# Altium schematic sheet USB-RS485_A2.SchDoc: Приставка
size 594 x 420 mm; ApprovedBy: Рогов; CheckedBy: Капустин Д.А.; DrawnBy: Нечаева А.Н.; DocumentNumber: СПбПУ 28.12.2018 ЭЗ; SheetTotal: 1; Format: A2; DocumentType: Схема электрическая принципиальная; Title1str: Преобразователя напряжения
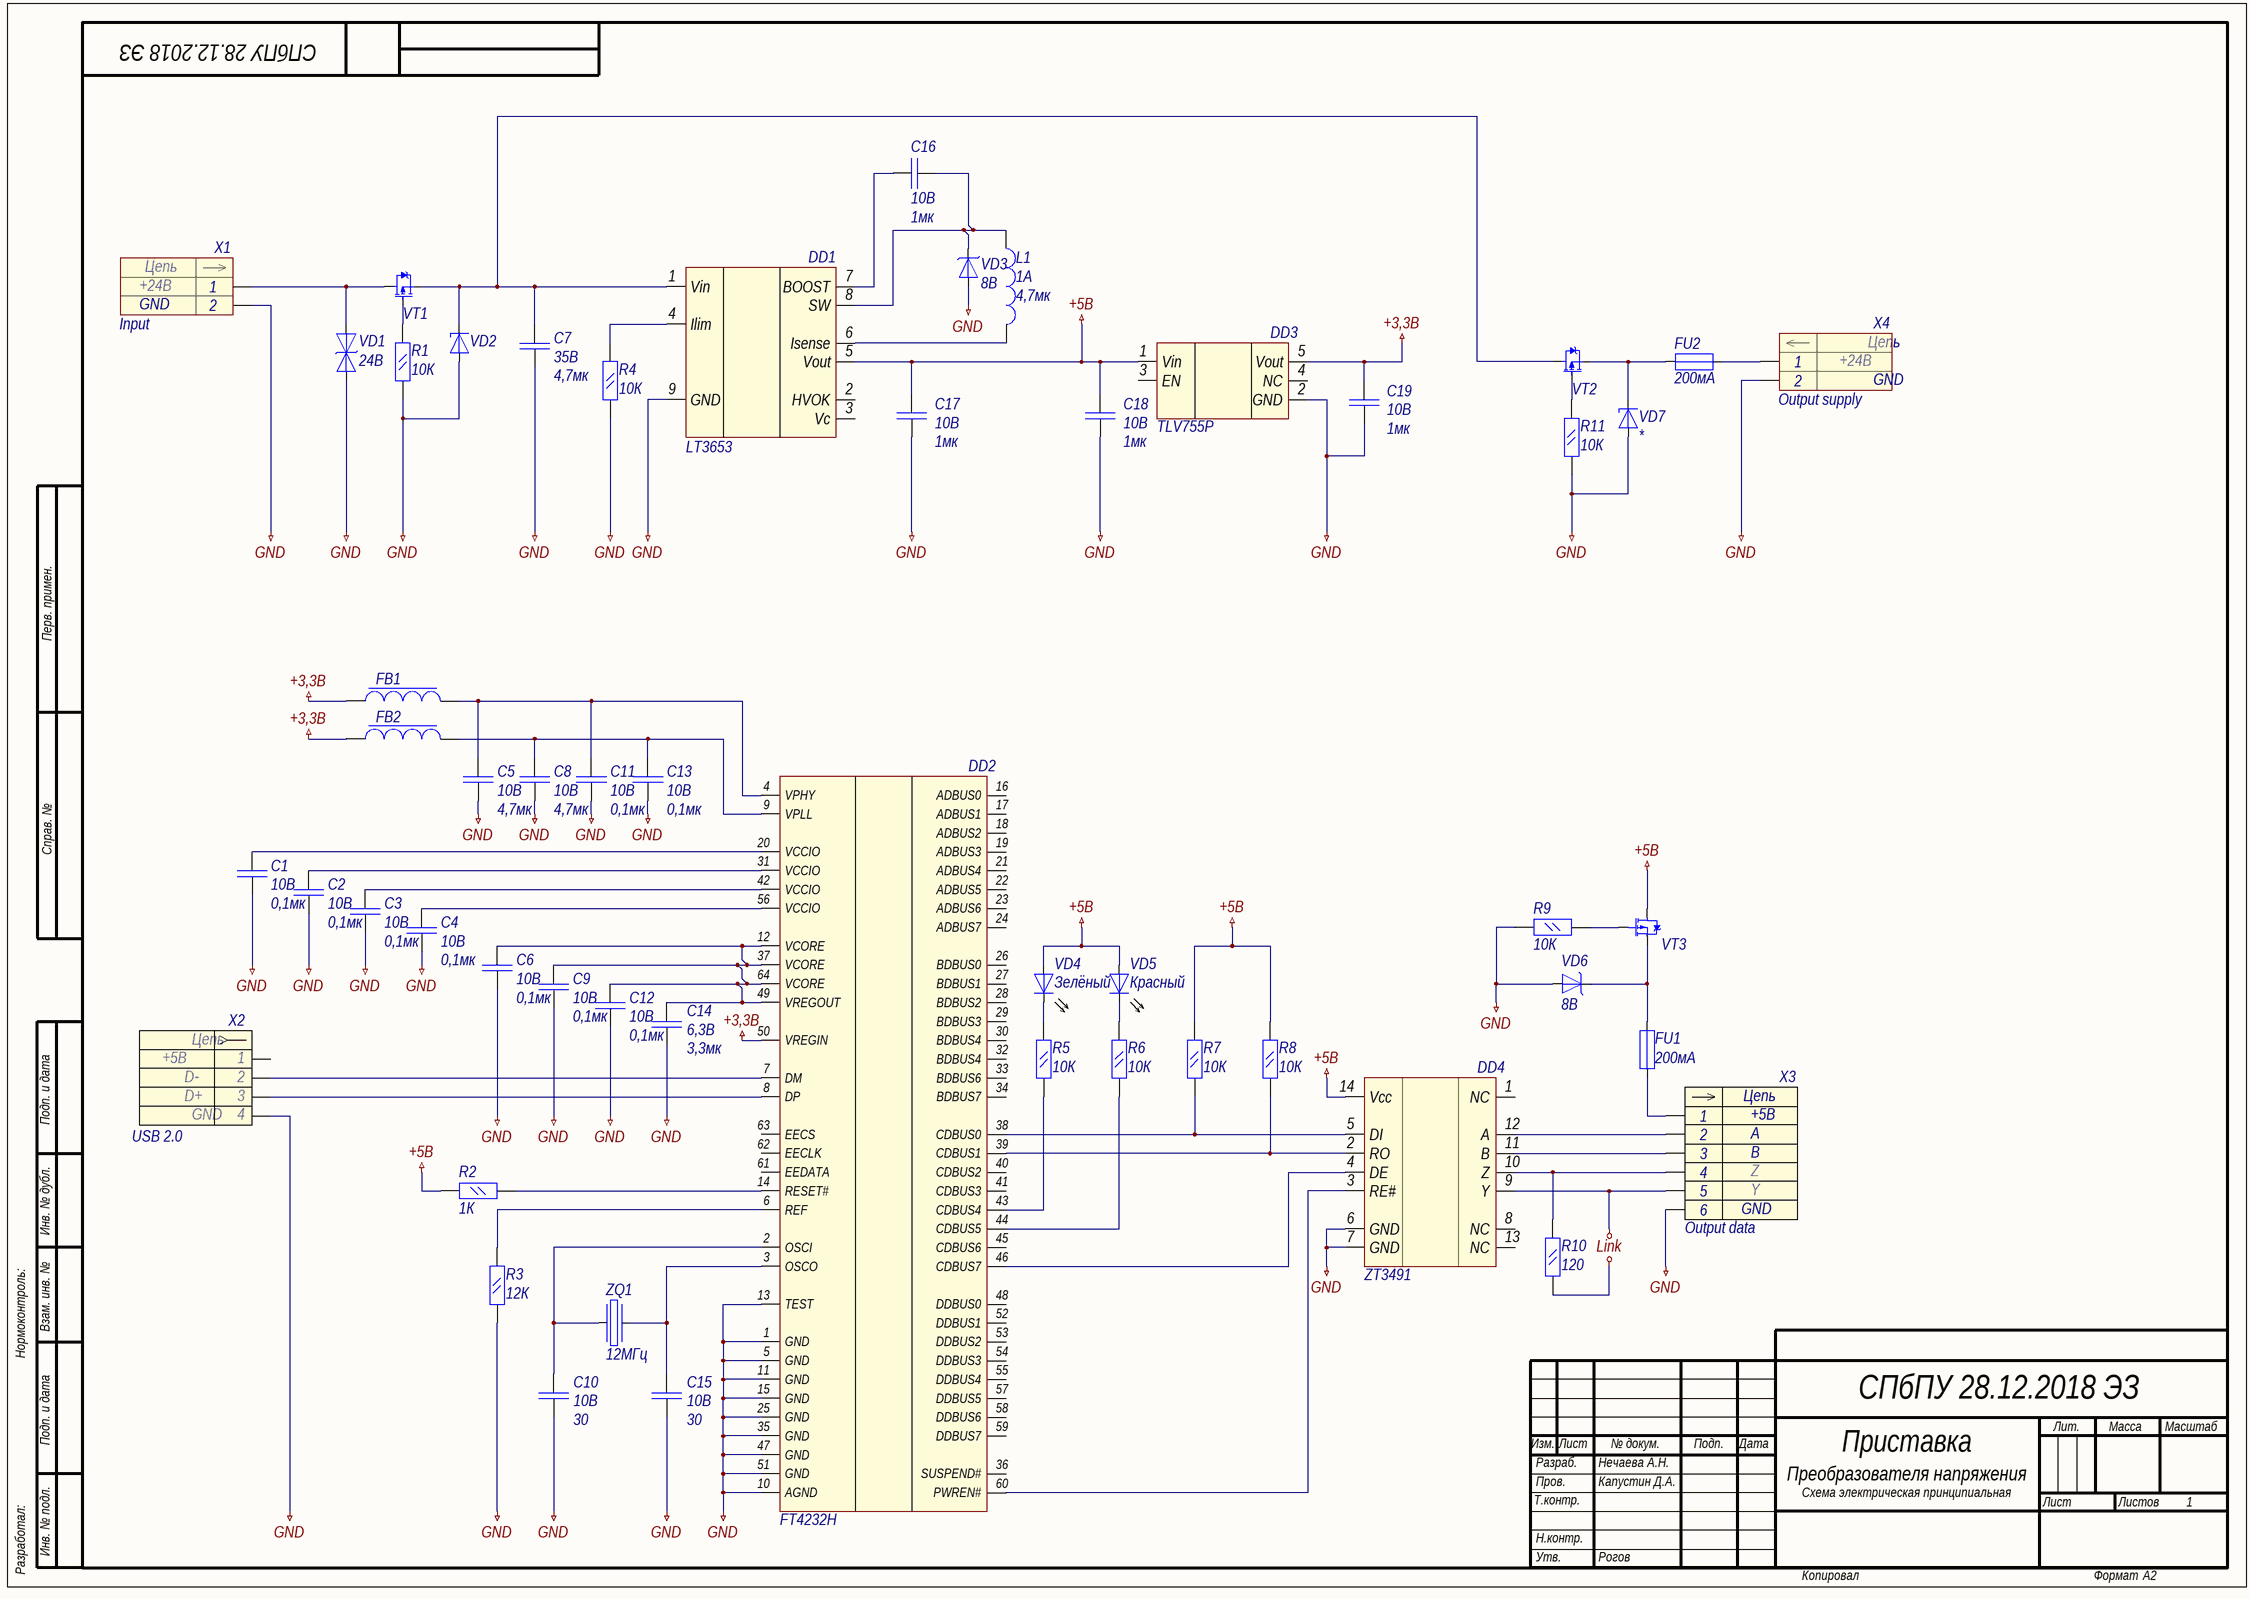
[diagram p0: USB-RS485_A2.SchDoc]

## Parts
C1  Voltage: 10В  Capacitance: 0,1мк  [CH0402C]  (hidden comment: Capacitor)
C2  Voltage: 10В  Capacitance: 0,1мк  [CH0402C]  (hidden comment: Capacitor)
C3  Voltage: 10В  Capacitance: 0,1мк  [CH0402C]  (hidden comment: Capacitor)
C4  Voltage: 10В  Capacitance: 0,1мк  [CH0402C]  (hidden comment: Capacitor)
C5  Voltage: 10В  Capacitance: 4,7мк  [CH0402C]  (hidden comment: Capacitor)
C6  Voltage: 10В  Capacitance: 0,1мк  [CH0402C]  (hidden comment: Capacitor)
C7  Voltage: 35В  Capacitance: 4,7мк  [CH0603C]  (hidden comment: Capacitor)
C8  Voltage: 10В  Capacitance: 4,7мк  [CH0402C]  (hidden comment: Capacitor)
C9  Voltage: 10В  Capacitance: 0,1мк  [CH0402C]  (hidden comment: Capacitor)
C10  Voltage: 10В  Capacitance: 30  [CH0201C]  (hidden comment: Capacitor)
C11  Voltage: 10В  Capacitance: 0,1мк  [CH0402C]  (hidden comment: Capacitor)
C12  Voltage: 10В  Capacitance: 0,1мк  [CH0402C]  (hidden comment: Capacitor)
C13  Voltage: 10В  Capacitance: 0,1мк  [CH0402C]  (hidden comment: Capacitor)
C14  Voltage: 6,3В  Capacitance: 3,3мк  [CH0402C]  (hidden comment: Capacitor)
C15  Voltage: 10В  Capacitance: 30  [CH0201C]  (hidden comment: Capacitor)
C16  Voltage: 10В  Capacitance: 1мк  [CH0201C]  (hidden comment: Capacitor)
C17  Voltage: 10В  Capacitance: 1мк  [CH0201C]  (hidden comment: Capacitor)
C18  Voltage: 10В  Capacitance: 1мк  [CH0201C]  (hidden comment: Capacitor)
C19  Voltage: 10В  Capacitance: 1мк  [CH0201C]  (hidden comment: Capacitor)
DD1  LT3653  [LT3653]
DD2  FT4232H  [FT4232]
DD3  TLV755P  [SOT23-5]
DD4  ZT3491  [ZT3485E]
FB1  Ferrite bead  [CH0805F]  (value not drawn)
FB2  Ferrite bead  [CH0805F]  (value not drawn)
FU1  value 200мА  [CH0402R]  (hidden comment: Fuse)
FU2  value 200мА  [CH0402R]  (hidden comment: Fuse)
L1  Max current: 1А  Inductance: 4,7мк  [CH0805L]  (hidden comment: Inductor)
R1  Impedance: 10К  [CH0402R]  (hidden comment: Res_0.125)
R2  Impedance: 1К  [CH0402R]  (hidden comment: Res_0.125)
R3  Impedance: 12К  [CH0805R]  (hidden comment: Res_0.125)
R4  Impedance: 10К  [CH0402R]  (hidden comment: Res_0.125)
R5  Impedance: 10К  [CH0402R]  (hidden comment: Res_0.125)
R6  Impedance: 10К  [CH0402R]  (hidden comment: Res_0.125)
R7  Impedance: 10К  [CH0402R]  (hidden comment: Res_0.125)
R8  Impedance: 10К  [CH0402R]  (hidden comment: Res_0.125)
R9  Impedance: 10К  [CH0402R]  (hidden comment: Res_0.125)
R10  Impedance: 120  [CH0402R]  (hidden comment: Res_0.125)
R11  Impedance: 10К  [CH0402R]  (hidden comment: Res_0.125)
VD1  Thresh_Voltage: 24В  [SOD323]  (hidden comment: TVS-diod_simmetrical)
VD2  Diod Zener  [SOD123]  (value not drawn)
VD3  Clamping_Voltage: 8В  [SOD123W]  (hidden comment: TVS-diod_directed)
VD4  Color: Зелёный  [CH0201L]  (hidden comment: Light_diod)
VD5  Color: Красный  [CH0201L]  (hidden comment: Light_diod)
VD6  Clamping_Voltage: 8В  [SOD123W]  (hidden comment: TVS-diod_directed)
VD7  Diod Zener  [SOD123]  (value not drawn)
VT1  P-Channel  [SOT23_132]  (value not drawn)
VT2  P-Channel  [SOT23_132]  (value not drawn)
VT3  *  [SOT23_132]  (value not drawn)
X1  Input  Vcc: +24В  [CON: 163-179PH-EX]
X2  USB 2.0  Vcc: +5В  [USB]
X3  Output data  Vcc: +5В  [CON: PBS-6]
X4  Output supply  Vcc: +24В  [CON: PBS-2]
ZQ1  value 12МГц  [OSC: 5032]  (hidden comment: Oscillator)

## Nets
+3,3В: C19.1(C1+) DD2.50(VREGIN) DD3.5(Vout) FB1.1(C1-) FB2.1(C1-)
+5В: C17.1(C1+) C18.1(C1+) DD1.5(Vout) DD3.1(Vin) DD4.14(Vcc) R2.2 R7.2 R8.2 VD4.1 VD5.1 VT3.2(D)
GND: C1.2(C1-) C2.2(C1-) C3.2(C1-) C4.2(C1-) C5.2(C1-) C6.2(C1-) C7.2(C1-) C8.2(C1-) C9.2(C1-) C10.2(C1-) C11.2(C1-) C12.2(C1-) C13.2(C1-) C14.2(C1-) C15.2(C1-) C17.2(C1-) C18.2(C1-) C19.2(C1-) DD1.9(GND) DD2.1(GND) DD2.5(GND) DD2.10(AGND) DD2.11(GND) DD2.13(TEST) DD2.15(GND) DD2.25(GND) DD2.35(GND) DD2.47(GND) DD2.51(GND) DD3.2(GND) DD4.6(GND) DD4.7(GND) R1.1 R3.1 R4.1 R9.2 R11.1 VD1.1(A) VD2.1(A) VD3.1(A) VD6.1(A) VD7.1(A) X1.2 X2.4 X3.6 X4.2
Link: DD4.9(Y) R10.1 X3.5
NetC1_1: C1.1(C1+) DD2.20(VCCIO)
NetC2_1: C2.1(C1+) DD2.31(VCCIO)
NetC3_1: C3.1(C1+) DD2.42(VCCIO)
NetC4_1: C4.1(C1+) DD2.56(VCCIO)
NetC5_1: C5.1(C1+) C11.1(C1+) DD2.4(VPHY) FB1.2
NetC6_1: C6.1(C1+) C9.1(C1+) C12.1(C1+) C14.1(C1+) DD2.12(VCORE) DD2.37(VCORE) DD2.49(VREGOUT) DD2.64(VCORE)
NetC7_1: C7.1(C1+) DD1.1(Vin) VD2.2(C) VT1.3(S) VT2.2(D)
NetC8_1: C8.1(C1+) C13.1(C1+) DD2.9(VPLL) FB2.2
NetC10_1: C10.1(C1+) DD2.2(OSCI) ZQ1.1
NetC15_1: C15.1(C1+) DD2.3(OSCO) ZQ1.3
NetC16_1: C16.1(C1+) DD1.7(BOOST)
NetC16_2: C16.2(C1-) DD1.8(SW) L1.1 VD3.2(C)
NetDD1_4: DD1.4(Ilim) R4.2
NetDD1_6: DD1.6(Isense) L1.2
NetDD2_6: DD2.6(REF) R3.2
NetDD2_7: DD2.7(DM) X2.2
NetDD2_8: DD2.8(DP) X2.3
NetDD2_14: DD2.14(RESET#) R2.1
NetDD2_38: DD2.38(CDBUS0) DD4.5(DI) R7.1
NetDD2_39: DD2.39(CDBUS1) DD4.2(RO) R8.1
NetDD2_43: DD2.43(CDBUS4) R5.1
NetDD2_44: DD2.44(CDBUS5) R6.1
NetDD2_46: DD2.46(CDBUS7) DD4.4(DE)
NetDD2_60: DD2.60(PWREN#) DD4.3(RE#)
NetDD4_10: DD4.10(Z) R10.2 X3.4
NetDD4_11: DD4.11(B) X3.3
NetDD4_12: DD4.12(A) X3.2
NetFU1_1: FU1.1 X3.1
NetFU1_2: FU1.2 VD6.2(C) VT3.3(S)
NetFU2_1: FU2.1 VD7.2(C) VT2.3(S)
NetFU2_2: FU2.2 X4.1
NetR1_2: R1.2 VT1.1(G)
NetR5_2: R5.2 VD4.2
NetR6_2: R6.2 VD5.2
NetR9_1: R9.1 VT3.1(G)
NetR11_2: R11.2 VT2.1(G)
NetVD1_2: VD1.2(C) VT1.2(D) X1.1

Not connected (* = marked no-connect by the designer): DD1 2(HVOK) 3(Vc); DD2 16(ADBUS0) 17(ADBUS1) 18(ADBUS2) 19(ADBUS3) 21(ADBUS4) 22(ADBUS5) 23(ADBUS6) 24(ADBUS7) 26(BDBUS0) 27(BDBUS1) 28(BDBUS2) 29(BDBUS3) 30(BDBUS4) 32(BDBUS4) 33(BDBUS6) 34(BDBUS7) 36(SUSPEND#) 40(CDBUS2) 41(CDBUS3) 45(CDBUS6) 48(DDBUS0) 52(DDBUS1) 53(DDBUS2) 54(DDBUS3) 55(DDBUS4) 57(DDBUS5) 58(DDBUS6) 59(DDBUS7) 61(EEDATA) 62(EECLK) 63(EECS); DD3 3(EN) 4(NC); DD4 1(NC) 8(NC) 13(NC); X2 1

## Notes on the sheet
- Перв. примен.
- Справ. №
- Подп. и дата
- Инв. № дубл.
- Нормоконтроль:
- Взам. инв. №
- Изм.
- Лист
- № докум.
- Подп.
- Дата
- Лит.
- Масса
- Масштаб
- Т.контр.
- Пров.
- Разраб.
- Листов
- Разработал:
- Инв. № подл.
- Н.контр.
- Утв.
- Копировал
- Формат
- (in symbol 2_pins) Цепь; GND
- (in symbol Full_Duplex_RS485) Цепь; GND
- (in symbol USB-A) Цепь; D-; D+; GND

## Library data of the parts
C1-C4 C6 C9 C11-C13 = Capacitor: Manufacture: AVX; Model: 0402ZD103KAT2A; Case: 0402; HelpURL: https://ru.mouser.com/ProductDetail/AVX/0402ZD103KAT2A?qs=sGAEpiMZZMs0AnBnWHyRQKdiqyDPVQdAu74W%2fwwRq8A%3d
C5 C8 = Capacitor: Manufacture: Murata Electronics; Model: ZRB15XR61A475KE01D; Case: 0402; HelpURL: https://ru.mouser.com/ProductDetail/Murata-Electronics/ZRB15XR61A475KE01D?qs=sGAEpiMZZMs0AnBnWHyRQO9VYadaKTO%252beZnE9zFUsbv4FmCibz4ZfQ%3d%3d
C7 = Capacitor: Manufacture: TDK; Model: C1608JB1V475M080AC; Case: 0603; HelpURL: https://ru.mouser.com/ProductDetail/TDK/C1608JB1V475M080AC?qs=sGAEpiMZZMs0AnBnWHyRQFv7x1xn%252bYFd6VAPnwlpyGEmZrVGUJGxTQ%3d%3d
C10 C15 = Capacitor: Manufacture: KEMET; Model: CBR02C308B8GAC; Case: 0201; HelpURL: https://ru.mouser.com/ProductDetail/KEMET/CBR02C308B8GAC?qs=sGAEpiMZZMs0AnBnWHyRQKJCfzG%2fi9wHnix1yOwfSPhOUzhoHh%252bTpQ%3d%3d
C14 = Capacitor: Manufacture: TDK; Model: C1005X5R0J335M050BC; Case: 0402; HelpURL: https://ru.mouser.com/ProductDetail/TDK/C1005X5R0J335M050BC?qs=sGAEpiMZZMs0AnBnWHyRQFzBYxg9rzNcvy5xMC7FxLU%3d
C16-C19 = Capacitor: Manufacture: Murata Electronics; Model: GRM033C81A105ME05E; Case: 0201; HelpURL: https://ru.mouser.com/ProductDetail/Murata-Electronics/GRM033C81A105ME05E?qs=sGAEpiMZZMs0AnBnWHyRQN7%2fAA2D2lPPXfhIkJ3ChWM%252bNp28BKy3Ug%3d%3d
DD1 = LT3653: 7.5~30 to 5; Case: *; Manufacture: *; Model: LT3653; HelpURL: *
DD2 = FT4232H: Ann; Manufactere: FTDI, Future Technology Devices International Ltd; HelpURL: https://www.ftdichip.com/Products/ICs/FT4232H.htm; Case: QFN-64; Model: FT4232H
DD3 = LDO +3.3V: Manufacture: Texas Instruments; Case: SOT-23; HelpUrL: http://www.ti.com/product/TLV755P?keyMatch=TLV755P&tisearch=Search-EN-Everything; Model: TLV755P
DD4 = ZT3491: UART - RS485; Manufacture: Zywyn; Case: nSOIC-14; Model: ZT3491; HelpURL: https://www.kynix.com/Detail/195117/ZT3483LEEN.html
FB1 FB2 = Ferrite bead: Manufacture: Laird; Model: MI0805K400R-10; Max DC current: 1,5А; Impedance: 40Ом; Case: 0805; HekpURL: https://www2.mouser.com/ProductDetail/Laird/MI0805K400R-10?qs=%2fha2pyFaduiHND%252bdjhHwYezPllDM7l6y0ARhTY4M0iGJeUtz%252byGA0A%3d%3d
L1 = Inductor: Manufacture: Panasonic; Model: ELG-TEA4R7NA; Impedance: 300м; HelpURL: https://ru.mouser.com/ProductDetail/Panasonic/ELG-TEA4R7NA?qs=sGAEpiMZZMsg%252by3WlYCkU%252bdHxGw%252bjF29VUqcX1cNOgM%3d; Case: 0805
R1 R4-R9 R11 = Res_0.125: Manufacture: Yageo; Model: AC0402FR-7W10KL; Case: 0402; HelpURL: https://ru.mouser.com/ProductDetail/Yageo/AC0402FR-7W10KL?qs=sGAEpiMZZMvdGkrng054txbN%2f5LBcxld3gyqgmBuiXRPLjwmdNqO3A%3d%3d
R2 = Res_0.125: Manufacture: KOA Speer; Model: SG73P1ETTP1001F; Case: 0402; HelpURL: https://ru.mouser.com/ProductDetail/KOA-Speer/SG73P1ETTP1001F?qs=sGAEpiMZZMvdGkrng054t%2f16WM9J8YovCYtiWkW5%2faA%3d
R3 = Res_0.125: Manufacture: Panasonic; Model: ERJ-6GEYK126V; Case: 0805; HelpURL: https://ru.mouser.com/ProductDetail/Panasonic/ERJ-6GEYK126V?qs=sGAEpiMZZMvdGkrng054t67Efho1F8r6k%252bzuIF5xRYA%3d
R10 = Res_0.125: Manufacture: KOA Speer; Model: SG73S1ETTP121J; Case: 0402; HelpURL: https://ru.mouser.com/ProductDetail/KOA-Speer/SG73S1ETTP121J?qs=sGAEpiMZZMvdGkrng054t%2f16WM9J8YovbyvN2zYhrU8%3d
VD1 = TVS-diod_simmetrical: Manufacturer: Torex Semiconductor; Model: XBP1012-G; Case: SOD-323P; HelpURL: https://ru.mouser.com/Semiconductors/Discrete-Semiconductors/Diodes-Rectifiers/TVS-Diodes-ESD-Suppressors/_/N-azknd?P=1z0z7ymZ1yzv44xZ1y95zfoZ1z0x69g&Ns=Package+%2f+Case%7c0
VD3 VD6 = TVS-diod_directed: Manufacturer: Nexperia; Model: PTVS3V3S1UTR,115; HelpURL: https://ru.mouser.com/ProductDetail/Nexperia/PTVS3V3S1UTR115?qs=sGAEpiMZZMsItbzKdwyIe55sLWjhUV0FnMtsDZGUovc%3d; Ipp: *; Case: SOD-123W
VD4 = Light_diod: Manufacture: Kingbright; Model: APG0603CGC-TT; Thresh_Voltage: 1,97В; If: 10мА; HelpURL: https://ru.mouser.com/ProductDetail/Kingbright/APG0603CGC-TT?qs=sGAEpiMZZMseGfSY3csMkWhaTYyynk7zmJSHZVA83x%252bt%2FzMFAtnBag%3D%3D
VD5 = Light_diod: Manufacture: Kingbright; Model: APG0603SURC-TT; Thresh_Voltage: 1,97В; If: 10мА; HelpURL: https://ru.mouser.com/ProductDetail/Kingbright/APG0603SURC-TT?qs=sGAEpiMZZMseGfSY3csMkWhaTYyynk7zWfpYoqHc%252biGwdyFqmyeODA%3D%3D
VT1 VT2 = P-Channel: Manufacture: Diodes Incorporated; Id: 3,4А; Model: DMP4065S-7; Vgs: 1В; Vsd: 40В; HelpURL: https://ru.mouser.com/ProductDetail/Diodes-Incorporated/DMP4065S-7?qs=sGAEpiMZZMshyDBzk1%2fWizUdW5KNcF83uXTduzoNpXIy82%252bBOlvohQ%3d%3d
VT3 = P-Channel: Manufacture: Vishay / Siliconix; Id: 6А; Model: SI2329DS-T1-GE3; Vgs: 350мВ; Vsd: 8В; HelpURL: https://ru.mouser.com/ProductDetail/Vishay-Siliconix/SI2329DS-T1-GE3?qs=sGAEpiMZZMshyDBzk1%2fWi0IfsQ3%2f3bgnEGeh9AiMdAo%3d
X1 X4 = 2_pins
  X1: HelpURL: https://ru.farnell.com/gct-global-connector-technology/dcj250-10-a-k1-k/dc-power-jack-5a-20vdc-black/dp/2524130?st=power%20jack
  X4: HelpURL: https://ru.mouser.com/ProductDetail/Harwin/M50-3140245R?qs=sGAEpiMZZMs%252bGHln7q6pm8Vn94ktop%2FJtmD0IM0sqjtMooR%2Fqw0FIA%3D%3D
X2 = USB-A: USB; Manufacturer: TE Connectivity; Model: 292303-2; HelpURL: https://www2.mouser.com/ProductDetail/Wurth-Electronics/629004113921?qs=35zkduByVmhHRkVkRjAlEQ==; ComponentKind: type A
X3 = Full_Duplex_RS485: Z: Z; Y: Y; A: A; B: B; HelpURL: https://ru.mouser.com/ProductDetail/Harwin/M50-3140645?qs=sGAEpiMZZMs%252bGHln7q6pm8Vn94ktop%2FJjOh82Azijbg9ipiItTiXHg%3D%3D
ZQ1 = Oscillator: Manufacture: CTS Electronic Components; HelpURL: https://ru.mouser.com/ProductDetail/CTS-Electronic-Components/636L3I012M00000?qs=sGAEpiMZZMtldj7qu1ydrWzf7LKZ2EliIlXd3ltxwts%3d; Model: https://ru.mouser.com/ProductDetail/CTS-Electronic-Components/636L3I012M00000?qs=sGAEpiMZZMtldj7qu1ydrWzf7LKZ2EliIlXd3ltxwts%3d
FU1 FU2 = Fuse: HelpURL: https://www2.mouser.com/ProductDetail/Bourns/SF-0402FP020F-2?qs=sGAEpiMZZMtxU2g%2f1juGqWJziY9CkRY0v%252bd32oCrRTr%2fW8XqdHGjQA%3d%3d
VD2 VD7 = Diod Zener: ComponentKind: *; Manufacturer: *; Model: *; HelpURL: *; Thresh_Voltage: *